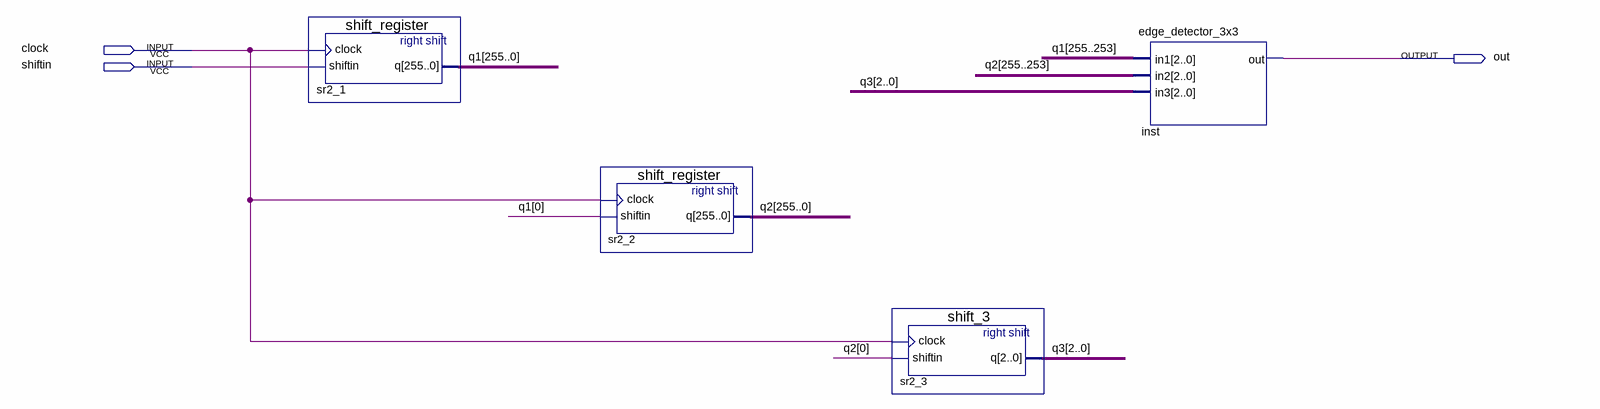
[diagram p0: schematic sheet]
// Quartus schematic modulo_borda.bdf as structural Verilog: 4 symbols, 3 pins
module modulo_borda (
  input  clock,
  input  shiftin,
  output out
);

  wire [2:0] q3;
  wire [255:0] q1, q2;

  shift_register sr2_1 (.clock(clock), .shiftin(shiftin), .q(q1));
  shift_register sr2_2 (.clock(clock), .shiftin(q1[0]), .q(q2));
  shift_3 sr2_3 (.clock(clock), .shiftin(q2[0]), .q(q3));
  edge_detector_3x3 inst (.in1(q1[255:253]), .in2(q2[255:253]), .in3(q3), .out(out));
endmodule
